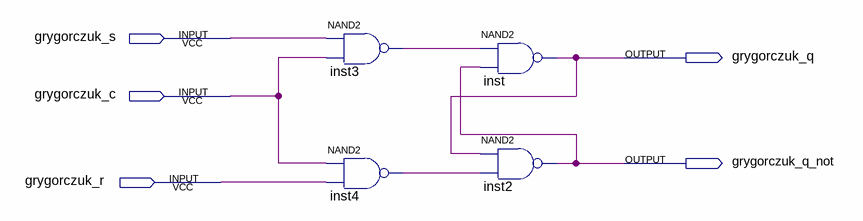
[diagram p0: schematic sheet]
// Quartus schematic CONTROL_SR_LATCH.bdf as structural Verilog: 4 symbols, 5 pins
module CONTROL_SR_LATCH (
  input  grygorczuk_s,
  input  grygorczuk_c,
  input  grygorczuk_r,
  output grygorczuk_q,
  output grygorczuk_q_not
);

  wire inst3_out, inst4_out;

  nand inst3 (inst3_out, grygorczuk_s, grygorczuk_c);
  nand inst4 (inst4_out, grygorczuk_c, grygorczuk_r);
  nand inst (grygorczuk_q, inst3_out, grygorczuk_q_not);
  nand inst2 (grygorczuk_q_not, grygorczuk_q, inst4_out);
endmodule
